# Altium project Multivibrator.PrjPcb
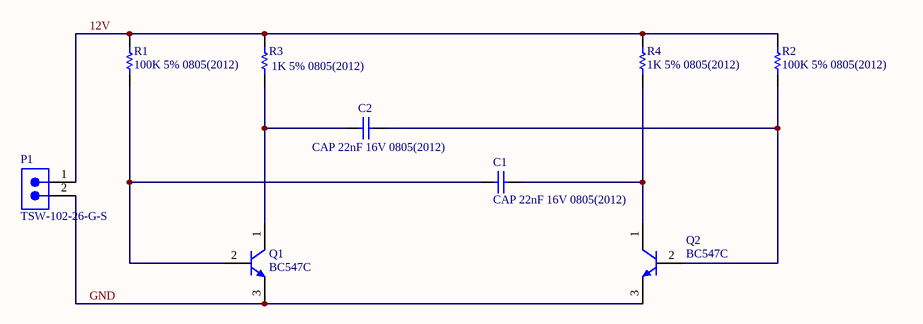
[diagram p0: Multivibrator.SchDoc]
1 sheet, 9 parts. Net scope: global (net labels, ports and power ports of the same name join across sheets).
Board file: Multivibrator.PcbDoc

## Sheet Multivibrator.SchDoc
size A4

### Parts
C1  CAP 22nF 16V 0805(2012)  [CAPC0805(2012)145_N]
C2  CAP 22nF 16V 0805(2012)  [CAPC0805(2012)145_N]
P1  TSW-102-26-G-S  [SMTC-TSW-102-26-XX-S]
Q1  BC547C  [ONSC-TO-92-3-29-11]
Q2  BC547C  [ONSC-TO-92-3-29-11]
R1  100K 5% 0805(2012)  [RESC0805(2012)_L]
R2  100K 5% 0805(2012)  [RESC0805(2012)_L]
R3  1K 5% 0805(2012)  [RESC0805(2012)_N]
R4  1K 5% 0805(2012)  [RESC0805(2012)_N]

### Nets
12V: P1.1 R1.2 R2.2 R3.2 R4.2
GND: P1.2 Q1.3(E) Q2.3(E)
NetC1_1: C1.1 Q1.2(B) R1.1
NetC1_2: C1.2 Q2.1(C) R4.1
NetC2_1: C2.1 Q1.1(C) R3.1
NetC2_2: C2.2 Q2.2(B) R2.1

### Library data of the parts
C1 C2 = CMP-1036-04042-1: CAP 22nF 16V ±10% 0805 (2012 Metric) Thickness 1.45mm SMD; Case-Metric: 2012; Case-EIA: 0805; Tolerance: Â±10%; Max Thickness: 1.45 mm; Technology: SMT; Value: 22nF; Rated Voltage: 16 V
P1 = CMP-1024-00327-1: 0.025" SQ Post Header, Through-hole, Vertical, -55 to 125 degC, 2.54 mm Pitch, 2-Pin, Male, RoHS; Manufacturer: Samtec; Pitch: 2.54 mm; Orientation: Vertical; ComponentLink3Description: Package Specification; PackageReference: TSW-102-26-XX-S; Mounting Technology: Through-hole; ComponentLink2Description: Datasheet; ComponentLink1URL: http://www.samtec.com; DatasheetVersion: F-214; ComponentLink1Description: Manufacturer URL; RoHS: True; ComponentLink2URL: http://www.samtec.com/documents/webfiles/pdf/TSW_TH.PDF; PartNumber: TSW-102-26-G-S; ComponentLink3URL: http://www.samtec.com/documents/webfiles/cpdf/TSW-XXX-XX-XXX-X-XX-XXX-MKT.pdf; PackageDescription: .025[0.64] SQ. Post Terminal Strip Assembly; PackageVersion: DM, 8/1988; Temperature Range: -55 to 125 degC
Q1 Q2 = CMP-1048-01437-1: Amplifier Transistor, NPN Silicon, 3-Pin TO-92, Bulk Box; Manufacturer: On Semiconductor; IC Continuous (A): 0.1; fT Min (MHz): 150; Mounting Technology: Through Hole; ComponentLink1URL: http://www.onsemi.com/; ComponentLink1Description: Manufacturer URL; ComponentLink3URL: http://www.onsemi.cn/pub_link/Collateral/2N6426-D.PDF; DatasheetVersion: Rev. 7; PackageVersion: Rev. AM; Packing: Bulk Box; RoHS: FALSE; Polarity: NPN; PartNumber: BC547C; ComponentLink2URL: http://www.onsemi.com/pub_link/Collateral/BC546-D.PDF; ComponentLink3Description: Package Specification; PackageDescription: 3-Pin Transistor Outline, Body 4.825 x 3.685 mm, Pitch 1.27 mm; PackageReference: TO-92-3-29-11_AM_SL; ComponentLink2Description: Datasheet
R1 R2 = CMP-1013-00122-1: 100K 0.125W 5% 0805 (2012 Metric)  SMD; Case-Metric: 2012; Value: 100000.00 Ohm; Case-EIA: 0805; Tolerance: 5 %; Technology: SMT; Power: 0.125 W
R3 R4 = CMP-1013-00074-1: 1K 0.125W 5% 0805 (2012 Metric)  SMD; Case-EIA: 0805; Case-Metric: 2012; Value: 1000.00 Ohm; Technology: SMT; Power: 0.125 W; Tolerance: 5 %